# Altium project SW_balance.PrjPcb (part 2 of 2)
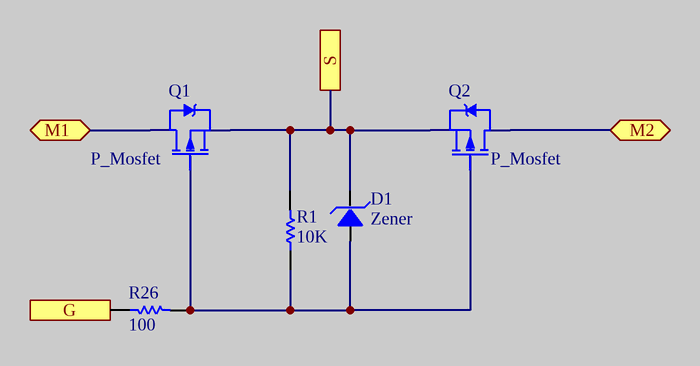
[diagram p13: bidirectional_switch.SchDoc]

## Nets that join several sheets
3V3: current_sensor_cells (D2A#1.2), current_sensor_ax (D2B#1.2), MCU (17 pins), power (C3.2 U2.2 U2.4), current_sensor_pack (D2C#1.2)
5V: current_sensor_cells (U5A.8), current_sensor_ax (U6A#1.8), communication (C5.1 U3.3), power (C2.2 C4.2 U1.3 U2.3), current_sensor_pack (U6B#1.8)
12V: main2020 (12V.1), power (C1.2 U1.1), driver_isolated_opto_pos_N4 (R15A.1), driver_isolated_opto_pos_N5 (R15B.1), driver_isolated_opto_pos_N6 (R15C.1), driver_isolated_opto_pos_N7 (R15D.1), driver_isolated_opto_pos_N8 (R15E.1), driver_isolated_opto_pos_N9 (R15F.1), driver_isolated_opto_neg_N5 (R15G.1), driver_isolated_opto_neg_N6 (R15H.1), driver_isolated_opto_neg_N7 (R15I.1), driver_isolated_opto_neg_N8 (R15J.1), driver_isolated_opto_neg_N9 (R15K.1), driver_isolated_opto_neg_N10 (R15L.1), driver_isolated_trans_pos_AXBATT_i (R19A#2.2), driver_isolated_trans_pos_AXBATT_i/opto_off (R15M.1), driver_isolated_trans_pos_DCDC_i (R19B#2.2), driver_isolated_trans_pos_DCDC_i/opto_off (R15N.1), driver_isolated_trans_pos_AXBATT_o (R19C#2.2), driver_isolated_trans_pos_AXBATT_o/opto_off (R15O.1), driver_isolated_opto_pos_N3 (R15P.1), driver_isolated_opto_pos_N2 (R15Q.1), driver_isolated_opto_pos_N1 (R15R.1), driver_isolated_opto_neg_N4 (R15S.1), driver_isolated_opto_neg_N3 (R15T.1), driver_isolated_opto_neg_N2 (R15U.1), driver_isolated_trans_neg_DCDC_o (R19D.2), driver_isolated_trans_neg_DCDC_o/opto_off (R15V.1), driver_isolated_trans_neg_DCDC_i (R19E.2), driver_isolated_trans_neg_DCDC_i/opto_off (R15W.1), driver_isolated_trans_neg_AXBATT_o (R19F.2), driver_isolated_trans_neg_AXBATT_o/opto_off (R15X.1), driver_isolated_trans_neg_AXBATT_i (R19G.2), driver_isolated_trans_neg_AXBATT_i/opto_off (R15Y.1), driver_isolated_trans_pos_DCDC_o (R19H.2), driver_isolated_trans_pos_DCDC_o/opto_off (R15Z.1)
CAN_N: main2020 (CAN.2), communication (R2.2 SM1.1 U3.7)
CAN_P: main2020 (CAN.1), communication (R3.1 SM1.2 U3.6)
GND: main2020 (12V.2 CAN.3 USART.3), current_sensor_cells (C25A.1 U5A.5), current_sensor_ax (C28A.1 U6A#1.5), MCU (33 pins), DCDC (D5.1 INPUT.2 R14.1), communication (C5.2 C6.2 SM1.3 U3.2), power (6 pins), current_sensor_pack (C28B.1 U6B#1.5), driver_isolated_opto_pos_N4 (Q5A.2 R18A.1), driver_isolated_opto_pos_N5 (Q5B.2 R18B.1), driver_isolated_opto_pos_N6 (Q5C.2 R18C.1), driver_isolated_opto_pos_N7 (Q5D.2 R18D.1), driver_isolated_opto_pos_N8 (Q5E.2 R18E.1), driver_isolated_opto_pos_N9 (Q5F.2 R18F.1), driver_isolated_opto_neg_N5 (Q5G.2 R18G.1), driver_isolated_opto_neg_N6 (Q5H.2 R18H.1), driver_isolated_opto_neg_N7 (Q5I.2 R18I.1), driver_isolated_opto_neg_N8 (Q5J.2 R18J.1), driver_isolated_opto_neg_N9 (Q5K.2 R18K.1), driver_isolated_opto_neg_N10 (Q5L.2 R18L.1), driver_isolated_trans_pos_AXBATT_i (Q6A.2 R24A.2), driver_isolated_trans_pos_AXBATT_i/opto_off (Q5M.2 R18M.1), driver_isolated_trans_pos_DCDC_i (Q6B.2 R24B.2), driver_isolated_trans_pos_DCDC_i/opto_off (Q5N.2 R18N.1), driver_isolated_trans_pos_AXBATT_o (Q6C.2 R24C.2), driver_isolated_trans_pos_AXBATT_o/opto_off (Q5O.2 R18O.1), driver_isolated_opto_pos_N3 (Q5P.2 R18P.1), driver_isolated_opto_pos_N2 (Q5Q.2 R18Q.1), driver_isolated_opto_pos_N1 (Q5R.2 R18R.1), driver_isolated_opto_neg_N4 (Q5S.2 R18S.1), driver_isolated_opto_neg_N3 (Q5T.2 R18T.1), driver_isolated_opto_neg_N2 (Q5U.2 R18U.1), bidirectional_switch_neg_DCDC_i (Q4R.2), driver_isolated_trans_neg_DCDC_o (Q6D.2 R24D.2), driver_isolated_trans_neg_DCDC_o/opto_off (Q5V.2 R18V.1), driver_isolated_trans_neg_DCDC_i (Q6E.2 R24E.2), driver_isolated_trans_neg_DCDC_i/opto_off (Q5W.2 R18W.1), bidirectional_switch_neg_AXBATT_i (Q3T.2), driver_isolated_trans_neg_AXBATT_o (Q6F.2 R24F.2), driver_isolated_trans_neg_AXBATT_o/opto_off (Q5X.2 R18X.1), driver_isolated_trans_neg_AXBATT_i (Q6G.2 R24G.2), driver_isolated_trans_neg_AXBATT_i/opto_off (Q5Y.2 R18Y.1), driver_isolated_trans_pos_DCDC_o (Q6H.2 R24H.2), driver_isolated_trans_pos_DCDC_o/opto_off (Q5Z.2 R18Z.1)
CAN_RX: MCU (U4.81), communication (U3.4)
CAN_STB: MCU (U4.62), communication (U3.8)
CAN_TX: MCU (U4.82), communication (U3.1)
clr_ax2pack_AXBATT_i_n: MCU (U4.31), driver_isolated_trans_neg_AXBATT_i/opto_off (R17Y.1 R18Y.2)
clr_ax2pack_AXBATT_i_p: MCU (U4.45), driver_isolated_trans_pos_AXBATT_i/opto_off (R17M.1 R18M.2)
clr_ax2pack_DCDC_o_p: MCU (U4.67), driver_isolated_trans_pos_DCDC_o/opto_off (R17Z.1 R18Z.2)
clr_pack2ax_AXBATT_o_n: MCU (U4.36), driver_isolated_trans_neg_AXBATT_o/opto_off (R17X.1 R18X.2)
clr_pack2ax_AXBATT_o_p: MCU (U4.54), driver_isolated_trans_pos_AXBATT_o/opto_off (R17O.1 R18O.2)
clr_pack2ax_DCDC_i_n: MCU (U4.39), driver_isolated_trans_neg_DCDC_i/opto_off (R17W.1 R18W.2)
clr_pack2ax_DCDC_i_p: MCU (U4.68), driver_isolated_trans_pos_DCDC_i/opto_off (R17N.1 R18N.2)
clr_pack2ax_DCDC_o_n: MCU (U4.42), driver_isolated_trans_neg_DCDC_o/opto_off (R17V.1 R18V.2)
CurrentSensor_AX: current_sensor_ax (D2B#1.1 R12B.2), MCU (U4.23)
CurrentSensor_cells: current_sensor_cells (D2A#1.1 R12A.2), MCU (U4.15)
CurrentSensor_pack: MCU (U4.24), current_sensor_pack (D2C#1.1 R12C.2)
DAC_Current: MCU (U4.29), DCDC (DCDC_CTRL.2)
DAC_Voltage: MCU (U4.28), DCDC (DCDC_CTRL.1)
DCDC_RST1: MCU (U4.71), DCDC (DCDC_CTRL.3)
en_ax2pack_AXBATT_i_n: MCU (U4.96), driver_isolated_trans_neg_AXBATT_i (R23G.2 R24G.1)
en_ax2pack_AXBATT_i_p: MCU (U4.63), driver_isolated_trans_pos_AXBATT_i (R23A.2 R24A.1)
en_ax2pack_DCDC_o_n: MCU (U4.59), driver_isolated_trans_neg_DCDC_o (R23D.2 R24D.1)
en_ax2pack_DCDC_o_p: MCU (U4.66), driver_isolated_trans_pos_DCDC_o (R23H.2 R24H.1)
en_pack2ax_AXBATT_o_n: MCU (U4.95), driver_isolated_trans_neg_AXBATT_o (R23F.2 R24F.1)
en_pack2ax_AXBATT_o_p: MCU (U4.65), driver_isolated_trans_pos_AXBATT_o (R23C.2 R24C.1)
en_pack2ax_DCDC_i_n: MCU (U4.60), driver_isolated_trans_neg_DCDC_i (R23E.2 R24E.1)
en_pack2ax_DCDC_i_p: MCU (U4.64), driver_isolated_trans_pos_DCDC_i (R23B.2 R24B.1)
M1_1: main2020 (BATT.1 F3.1 SB2.1), current_sensor_pack (U6B#1.1 U6B#1.2), driver_isolated_opto_pos_N4 (U6A#2.4)
M1_1_cs: main2020 (F12.1 SB2.2), current_sensor_pack (U6B#1.3 U6B#1.4)
M1_2: main2020 (BATT.2 F4.1), driver_isolated_opto_pos_N5 (U6B#2.4), driver_isolated_opto_neg_N5 (U6G.4), bidirectional_switch_neg_N2 (Q1D.2)
M1_3: main2020 (BATT.3 F5.1), driver_isolated_opto_pos_N6 (U6C.4), driver_isolated_opto_neg_N6 (U6H.4), bidirectional_switch_neg_N3 (Q1E.2)
M1_4: main2020 (BATT.4 F6.1), driver_isolated_opto_pos_N7 (U6D.4), driver_isolated_opto_neg_N7 (U6I.4), driver_isolated_opto_pos_N1 (U6R.3), bidirectional_switch_neg_N4 (Q1F.2)
M1_5: main2020 (BATT.5 F7.1), bidirectional_switch_neg_N5 (Q3G.2), driver_isolated_opto_pos_N8 (U6E.4), driver_isolated_opto_neg_N8 (U6J.4), driver_isolated_opto_pos_N2 (U6Q.3), driver_isolated_opto_neg_N2 (U6U.3)
M1_6: main2020 (BATT.6 F8.1), bidirectional_switch_neg_N6 (Q3H.2), driver_isolated_opto_pos_N9 (U6F.4), driver_isolated_opto_neg_N9 (U6K.4), driver_isolated_opto_pos_N3 (U6P.3), driver_isolated_opto_neg_N3 (U6T.3)
M1_7: main2020 (BATT.7 F9.1), bidirectional_switch_neg_N7 (Q3I.2), driver_isolated_opto_neg_N10 (U6L.4), driver_isolated_opto_neg_N4 (U6S.3)
M1_8: main2020 (BATT.8 F10.1), bidirectional_switch_neg_N8 (Q3J.2)
M1_9: main2020 (BATT.9 F11.1), bidirectional_switch_neg_N9 (Q3K.2)
M1_10: main2020 (BATT.10 LOAD.2), bidirectional_switch_neg_N10 (Q3L.2)
M2_neg: bidirectional_switch_neg_N5 (Q4G.2), bidirectional_switch_neg_N6 (Q4H.2), bidirectional_switch_neg_N7 (Q4I.2), bidirectional_switch_neg_N8 (Q4J.2), bidirectional_switch_neg_N9 (Q4K.2), bidirectional_switch_neg_N10 (Q4L.2), bidirectional_switch_neg_N2 (Q2D.2), bidirectional_switch_neg_N3 (Q2E.2), bidirectional_switch_neg_N4 (Q2F.2), bidirectional_switch_neg_DCDC_o (Q3Q.2), bidirectional_switch_neg_DCDC_i (Q3R.2)
M2_pos: main2020 (SB1.1), current_sensor_cells (U5A.1 U5A.2), bidirectional_switch_pos_N4 (Q4A.2), bidirectional_switch_pos_N5 (Q4B.2), bidirectional_switch_pos_N6 (Q4C.2), bidirectional_switch_pos_N7 (Q4D.2), bidirectional_switch_pos_N8 (Q4E.2), bidirectional_switch_pos_N9 (Q4F.2), bidirectional_switch_pos_N1 (Q2A.2), bidirectional_switch_pos_N2 (Q2B.2), bidirectional_switch_pos_N3 (Q2C.2)
M2_pos_sensed: main2020 (SB1.2), current_sensor_cells (U5A.3 U5A.4), bidirectional_switch_pos_DCDC_o (Q3M.2), bidirectional_switch_pos_DCDC_i (Q3O.2)
NetAXBATT_2: main2020 (AXBATT.2 D6.1), bidirectional_switch_neg_AXBATT_o (Q4S.2), bidirectional_switch_neg_AXBATT_i (Q4T.2)
NetD3M_1: bidirectional_switch_pos_DCDC_o (D3M.1 Q3M.3 Q4M.3 R13M.1), driver_isolated_trans_pos_DCDC_o (R21H.1 R22H.1 Tr1H.3), driver_isolated_trans_pos_DCDC_o/opto_off (U6Z.3)
NetD3N_1: driver_isolated_trans_pos_AXBATT_i (R21A.1 R22A.1 Tr1A.3), driver_isolated_trans_pos_AXBATT_i/opto_off (U6M.3), bidirectional_switch_pos_AXBATT_i (D3N.1 Q3N.3 Q4N.3 R13N.1)
NetD3O_1: driver_isolated_trans_pos_DCDC_i (R21B.1 R22B.1 Tr1B.3), driver_isolated_trans_pos_DCDC_i/opto_off (U6N.3), bidirectional_switch_pos_DCDC_i (D3O.1 Q3O.3 Q4O.3 R13O.1)
NetD3P_1: driver_isolated_trans_pos_AXBATT_o (R21C.1 R22C.1 Tr1C.3), driver_isolated_trans_pos_AXBATT_o/opto_off (U6O.3), bidirectional_switch_pos_AXBATT_o (D3P.1 Q3P.3 Q4P.3 R13P.1)
NetD3Q_1: bidirectional_switch_neg_DCDC_o (D3Q.1 Q3Q.3 Q4Q.3 R13Q.1), driver_isolated_trans_neg_DCDC_o (R21D.1 R22D.1 Tr1D.3), driver_isolated_trans_neg_DCDC_o/opto_off (U6V.3)
NetD3R_1: bidirectional_switch_neg_DCDC_i (D3R.1 Q3R.3 Q4R.3 R13R.1), driver_isolated_trans_neg_DCDC_i (R21E.1 R22E.1 Tr1E.3), driver_isolated_trans_neg_DCDC_i/opto_off (U6W.3)
NetD3S_1: bidirectional_switch_neg_AXBATT_o (D3S.1 Q3S.3 Q4S.3 R13S.1), driver_isolated_trans_neg_AXBATT_o (R21F.1 R22F.1 Tr1F.3), driver_isolated_trans_neg_AXBATT_o/opto_off (U6X.3)
NetD3T_1: bidirectional_switch_neg_AXBATT_i (D3T.1 Q3T.3 Q4T.3 R13T.1), driver_isolated_trans_neg_AXBATT_i (R21G.1 R22G.1 Tr1G.3), driver_isolated_trans_neg_AXBATT_i/opto_off (U6Y.3)
NetD4_1: DCDC (D4.1 OUTPUT.2), bidirectional_switch_neg_DCDC_o (Q4Q.2), bidirectional_switch_neg_AXBATT_o (Q3S.2)
NetD4_2: DCDC (D4.2 F2.1), bidirectional_switch_pos_DCDC_o (Q4M.2), bidirectional_switch_pos_AXBATT_o (Q3P.2)
NetD5_2: DCDC (D5.2 F1.1), bidirectional_switch_pos_AXBATT_i (Q3N.2), bidirectional_switch_pos_DCDC_i (Q4O.2)
NetD6_2: main2020 (D6.2 F13.1 SB3.2), current_sensor_ax (U6A#1.1 U6A#1.2)
NetD7A_2: driver_isolated_trans_pos_AXBATT_i (D7A.2 R20A.2), driver_isolated_trans_pos_AXBATT_i/opto_off (U6M.4)
NetD7B_2: driver_isolated_trans_pos_DCDC_i (D7B.2 R20B.2), driver_isolated_trans_pos_DCDC_i/opto_off (U6N.4)
NetD7C_2: driver_isolated_trans_pos_AXBATT_o (D7C.2 R20C.2), driver_isolated_trans_pos_AXBATT_o/opto_off (U6O.4)
NetD7D_2: driver_isolated_trans_neg_DCDC_o (D7D.2 R20D.2), driver_isolated_trans_neg_DCDC_o/opto_off (U6V.4)
NetD7E_2: driver_isolated_trans_neg_DCDC_i (D7E.2 R20E.2), driver_isolated_trans_neg_DCDC_i/opto_off (U6W.4)
NetD7F_2: driver_isolated_trans_neg_AXBATT_o (D7F.2 R20F.2), driver_isolated_trans_neg_AXBATT_o/opto_off (U6X.4)
NetD7G_2: driver_isolated_trans_neg_AXBATT_i (D7G.2 R20G.2), driver_isolated_trans_neg_AXBATT_i/opto_off (U6Y.4)
NetD7H_2: driver_isolated_trans_pos_DCDC_o (D7H.2 R20H.2), driver_isolated_trans_pos_DCDC_o/opto_off (U6Z.4)
NetF3_2: main2020 (F3.2), bidirectional_switch_pos_N1 (Q1A.2)
NetF4_2: main2020 (F4.2), bidirectional_switch_pos_N2 (Q1B.2)
NetF5_2: main2020 (F5.2), bidirectional_switch_pos_N3 (Q1C.2)
NetF6_2: main2020 (F6.2), bidirectional_switch_pos_N4 (Q3A.2)
NetF7_2: main2020 (F7.2), bidirectional_switch_pos_N5 (Q3B.2)
NetF8_2: main2020 (F8.2), bidirectional_switch_pos_N6 (Q3C.2)
NetF9_2: main2020 (F9.2), bidirectional_switch_pos_N7 (Q3D.2)
NetF10_2: main2020 (F10.2), bidirectional_switch_pos_N8 (Q3E.2)
NetF11_2: main2020 (F11.2), bidirectional_switch_pos_N9 (Q3F.2)
NetQ4N_2: main2020 (SB3.1), current_sensor_ax (U6A#1.3 U6A#1.4), bidirectional_switch_pos_AXBATT_i (Q4N.2), bidirectional_switch_pos_AXBATT_o (Q4P.2)
NetR20A_1: driver_isolated_trans_pos_AXBATT_i (R20A.1 R22A.2), bidirectional_switch_pos_AXBATT_i (R25N.1)
NetR20B_1: driver_isolated_trans_pos_DCDC_i (R20B.1 R22B.2), bidirectional_switch_pos_DCDC_i (R25O.1)
NetR20C_1: driver_isolated_trans_pos_AXBATT_o (R20C.1 R22C.2), bidirectional_switch_pos_AXBATT_o (R25P.1)
NetR20D_1: bidirectional_switch_neg_DCDC_o (R25Q.1), driver_isolated_trans_neg_DCDC_o (R20D.1 R22D.2)
NetR20E_1: bidirectional_switch_neg_DCDC_i (R25R.1), driver_isolated_trans_neg_DCDC_i (R20E.1 R22E.2)
NetR20F_1: bidirectional_switch_neg_AXBATT_o (R25S.1), driver_isolated_trans_neg_AXBATT_o (R20F.1 R22F.2)
NetR20G_1: bidirectional_switch_neg_AXBATT_i (R25T.1), driver_isolated_trans_neg_AXBATT_i (R20G.1 R22G.2)
NetR20H_1: bidirectional_switch_pos_DCDC_o (R25M.1), driver_isolated_trans_pos_DCDC_o (R20H.1 R22H.2)
NetR25A_1: bidirectional_switch_pos_N4 (R25A.1), driver_isolated_opto_pos_N4 (U6A#2.3)
NetR25B_1: bidirectional_switch_pos_N5 (R25B.1), driver_isolated_opto_pos_N5 (U6B#2.3)
NetR25C_1: bidirectional_switch_pos_N6 (R25C.1), driver_isolated_opto_pos_N6 (U6C.3)
NetR25D_1: bidirectional_switch_pos_N7 (R25D.1), driver_isolated_opto_pos_N7 (U6D.3)
NetR25E_1: bidirectional_switch_pos_N8 (R25E.1), driver_isolated_opto_pos_N8 (U6E.3)
NetR25F_1: bidirectional_switch_pos_N9 (R25F.1), driver_isolated_opto_pos_N9 (U6F.3)
NetR25G_1: bidirectional_switch_neg_N5 (R25G.1), driver_isolated_opto_neg_N5 (U6G.3)
NetR25H_1: bidirectional_switch_neg_N6 (R25H.1), driver_isolated_opto_neg_N6 (U6H.3)
NetR25I_1: bidirectional_switch_neg_N7 (R25I.1), driver_isolated_opto_neg_N7 (U6I.3)
NetR25J_1: bidirectional_switch_neg_N8 (R25J.1), driver_isolated_opto_neg_N8 (U6J.3)
NetR25K_1: bidirectional_switch_neg_N9 (R25K.1), driver_isolated_opto_neg_N9 (U6K.3)
NetR25L_1: bidirectional_switch_neg_N10 (R25L.1), driver_isolated_opto_neg_N10 (U6L.3)
NetR26A_1: driver_isolated_opto_pos_N1 (U6R.4), bidirectional_switch_pos_N1 (R26A.1)
NetR26B_1: driver_isolated_opto_pos_N2 (U6Q.4), bidirectional_switch_pos_N2 (R26B.1)
NetR26C_1: driver_isolated_opto_pos_N3 (U6P.4), bidirectional_switch_pos_N3 (R26C.1)
NetR26D_1: driver_isolated_opto_neg_N2 (U6U.4), bidirectional_switch_neg_N2 (R26D.1)
NetR26E_1: driver_isolated_opto_neg_N3 (U6T.4), bidirectional_switch_neg_N3 (R26E.1)
NetR26F_1: driver_isolated_opto_neg_N4 (U6S.4), bidirectional_switch_neg_N4 (R26F.1)
trig_neg_2: MCU (U4.25), driver_isolated_opto_neg_N2 (R17U.1 R18U.2)
trig_neg_3: MCU (U4.32), driver_isolated_opto_neg_N3 (R17T.1 R18T.2)
trig_neg_4: MCU (U4.37), driver_isolated_opto_neg_N4 (R17S.1 R18S.2)
trig_neg_5: MCU (U4.40), driver_isolated_opto_neg_N5 (R17G.1 R18G.2)
trig_neg_6: MCU (U4.43), driver_isolated_opto_neg_N6 (R17H.1 R18H.2)
trig_neg_7: MCU (U4.46), driver_isolated_opto_neg_N7 (R17I.1 R18I.2)
trig_neg_8: MCU (U4.55), driver_isolated_opto_neg_N8 (R17J.1 R18J.2)
trig_neg_9: MCU (U4.58), driver_isolated_opto_neg_N9 (R17K.1 R18K.2)
trig_neg_10: MCU (U4.69), driver_isolated_opto_neg_N10 (R17L.1 R18L.2)
trig_pos_1: MCU (U4.30), driver_isolated_opto_pos_N1 (R17R.1 R18R.2)
trig_pos_2: MCU (U4.33), driver_isolated_opto_pos_N2 (R17Q.1 R18Q.2)
trig_pos_3: MCU (U4.38), driver_isolated_opto_pos_N3 (R17P.1 R18P.2)
trig_pos_4: MCU (U4.41), driver_isolated_opto_pos_N4 (R17A.1 R18A.2)
trig_pos_5: MCU (U4.44), driver_isolated_opto_pos_N5 (R17B.1 R18B.2)
trig_pos_6: MCU (U4.53), driver_isolated_opto_pos_N6 (R17C.1 R18C.2)
trig_pos_7: MCU (U4.56), driver_isolated_opto_pos_N7 (R17D.1 R18D.2)
trig_pos_8: MCU (U4.57), driver_isolated_opto_pos_N8 (R17E.1 R18E.2)
trig_pos_9: MCU (U4.70), driver_isolated_opto_pos_N9 (R17F.1 R18F.2)
USART_RX: main2020 (USART.2), MCU (U4.52)
USART_TX: main2020 (USART.1), MCU (U4.51)